# EAGLE schematic Soap (EAGLE 7.2.0)

## Sheet 1 of 2
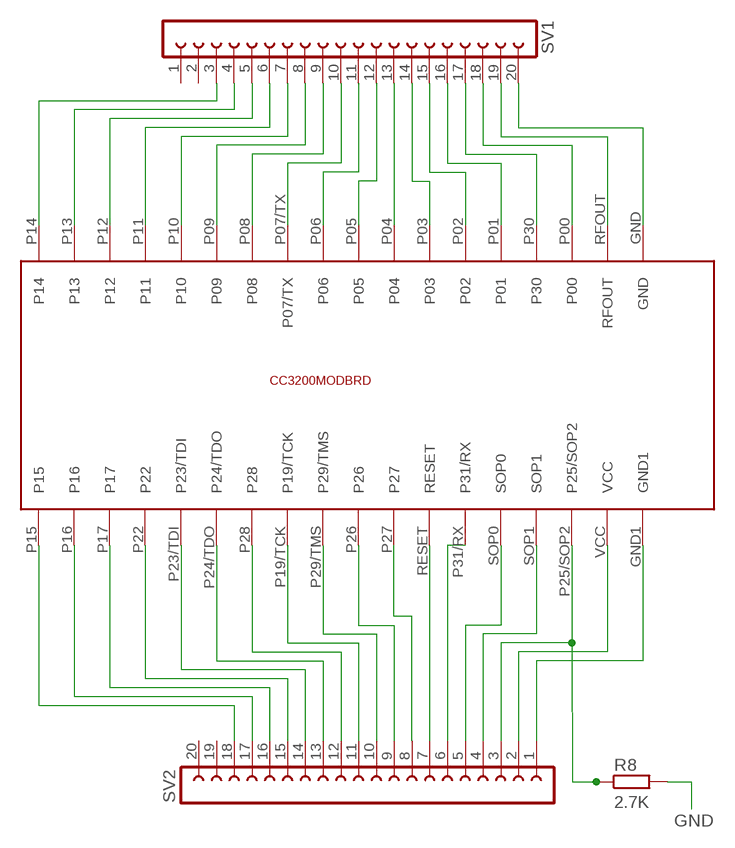
[diagram p0: schematic, sheet 1]

### Parts
R8  2.7K  RESISTOR  [R0603]
SV1  FE20-1  [FE20]
SV2  FE20-1  [FE20]
U$1  CC3200MOD  [CC3200MOD]

### Nets
+3V3: SV2.2 U$1.VCC
GND [vcc]: R8.2 SV1.20 SV2.1 U$1.GND U$1.GND1 ; also sheet 2
N$4: SV2.18 U$1.P15
N$6: SV2.17 U$1.P16
N$7: SV2.16 U$1.P17
N$8: SV2.15 U$1.P22
N$9: SV2.14 U$1.P23/TDI
N$10: SV2.13 U$1.P24/TDO
N$11: SV2.12 U$1.P28
N$12: SV2.11 U$1.P19/TCK
N$13: SV2.10
N$14: SV1.3 U$1.P14
N$15: SV1.4 U$1.P13
N$16: SV1.5 U$1.P12
N$17: SV1.6 U$1.P11
N$18: SV1.7 U$1.P10
N$19: SV1.8 U$1.P09
N$20: SV1.9 U$1.P08
N$21: SV1.10 U$1.P07/TX
N$22: SV1.11 U$1.P06
N$23: SV1.12 U$1.P05
N$24: SV1.13 U$1.P04
N$25: SV1.14 U$1.P03
N$26: SV1.15 U$1.P02
N$27: SV1.16 U$1.P01
N$28: SV1.17 U$1.P30
N$29: SV1.18 U$1.P00
N$30: SV1.19 U$1.RFOUT
N$32: SV2.9 U$1.P26
N$33: SV2.8 U$1.P27
N$34: SV2.7 U$1.RESET
N$35: SV2.6 U$1.P31/RX
N$36: SV2.5 U$1.SOP0
N$37: SV2.4 U$1.SOP1
SOP2: R8.1 SV2.3 U$1.P25/SOP2
Unconnected: SV1.1 SV1.2 SV2.19 SV2.20 U$1.P29/TMS

## Sheet 2 of 2
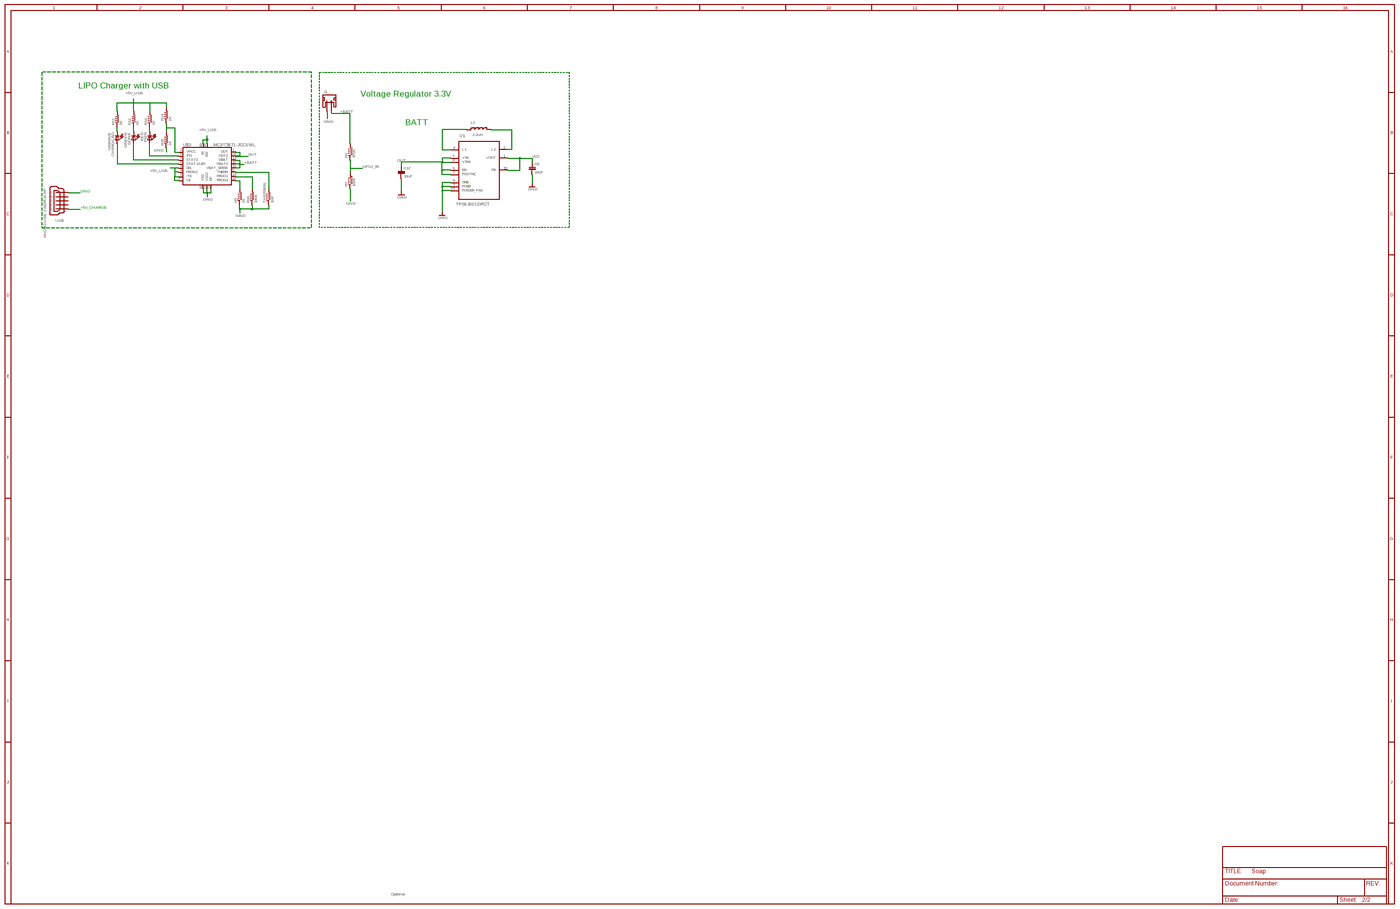
[diagram p1: schematic, sheet 2, overview]
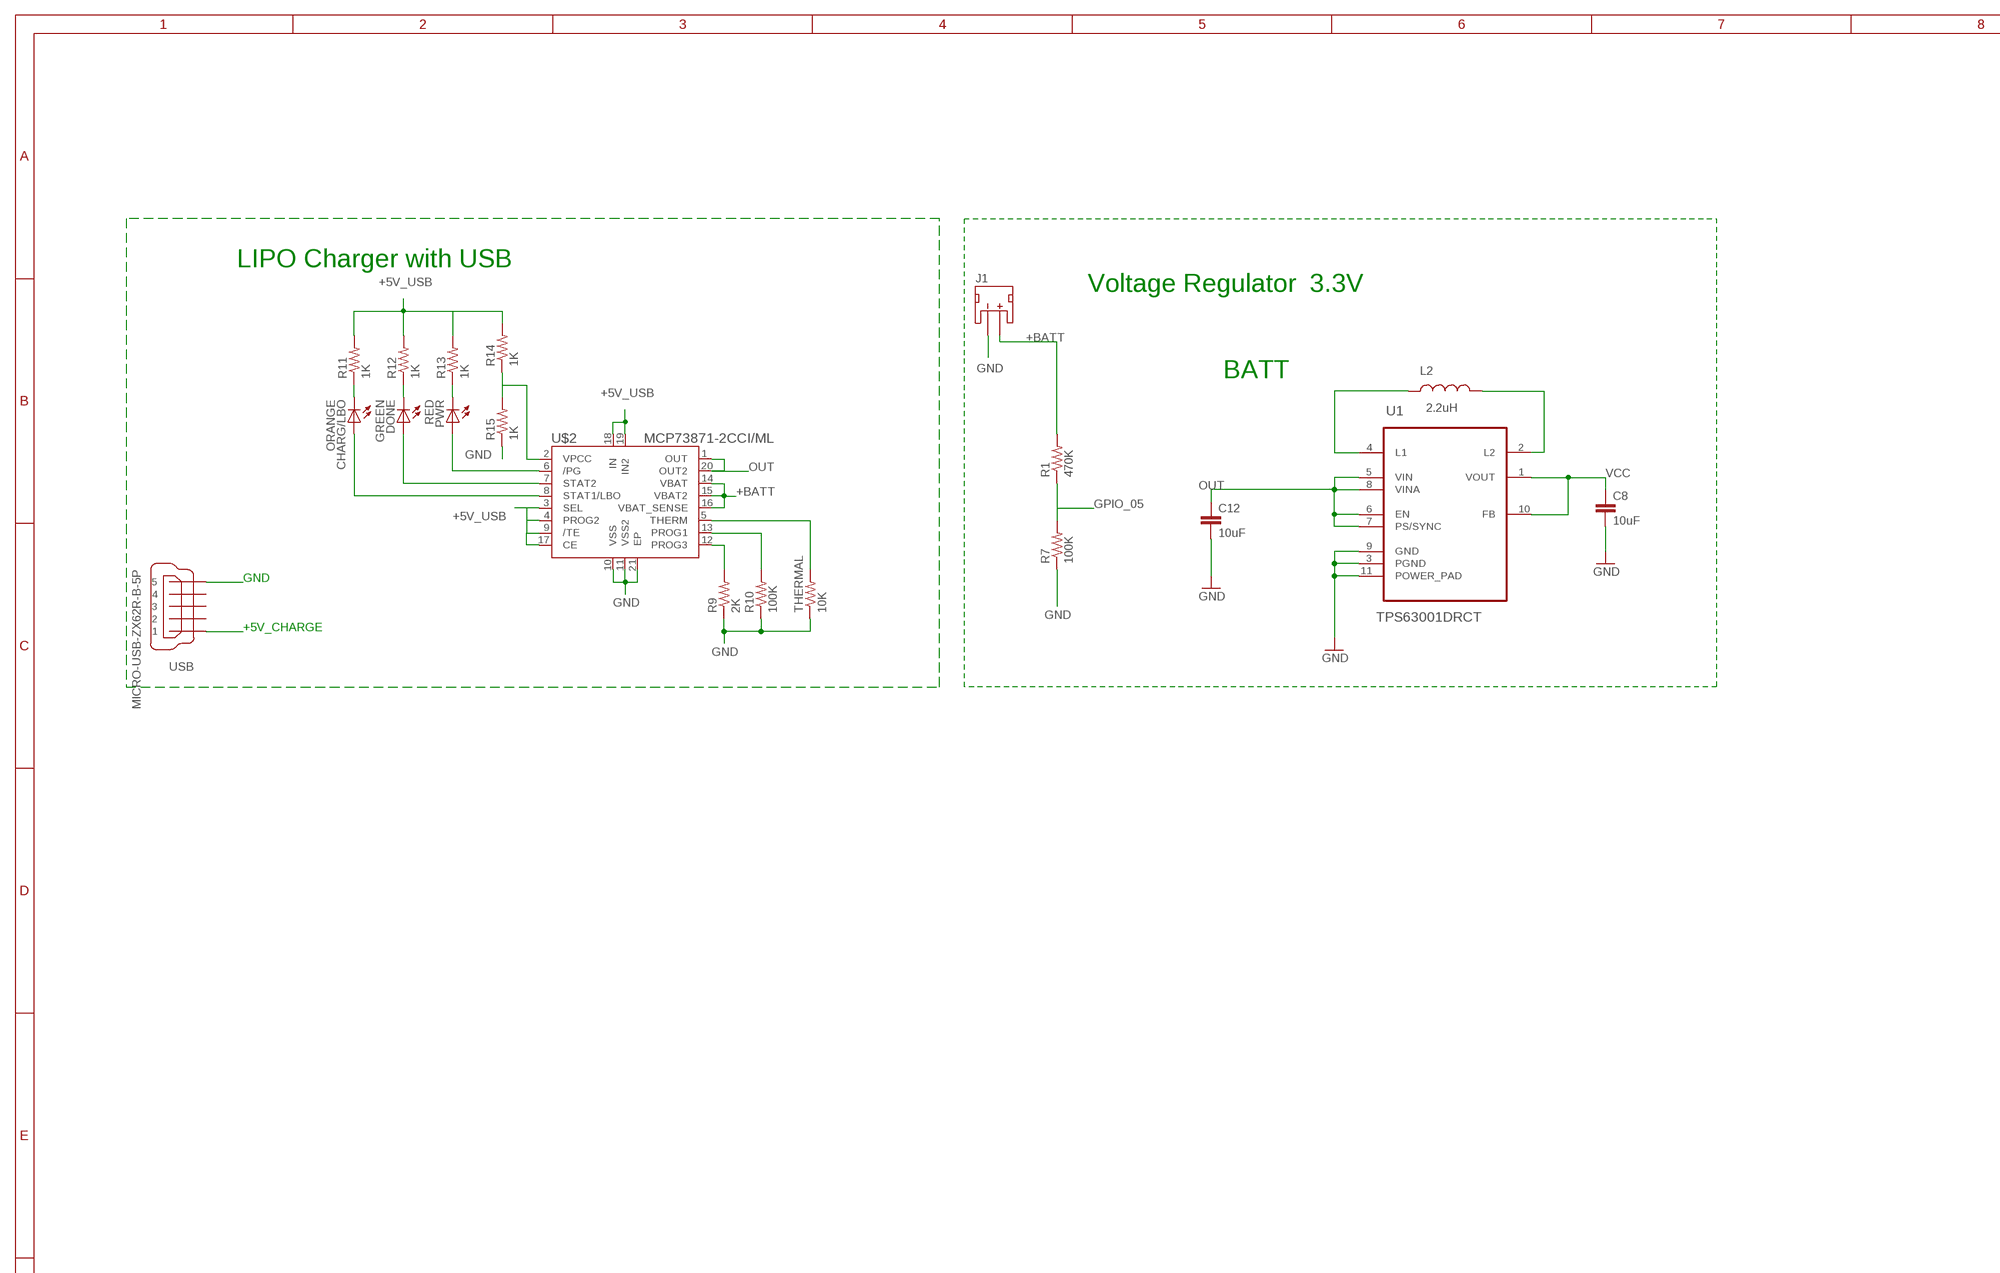
[diagram p2: schematic, sheet 2, part 1 of 4]
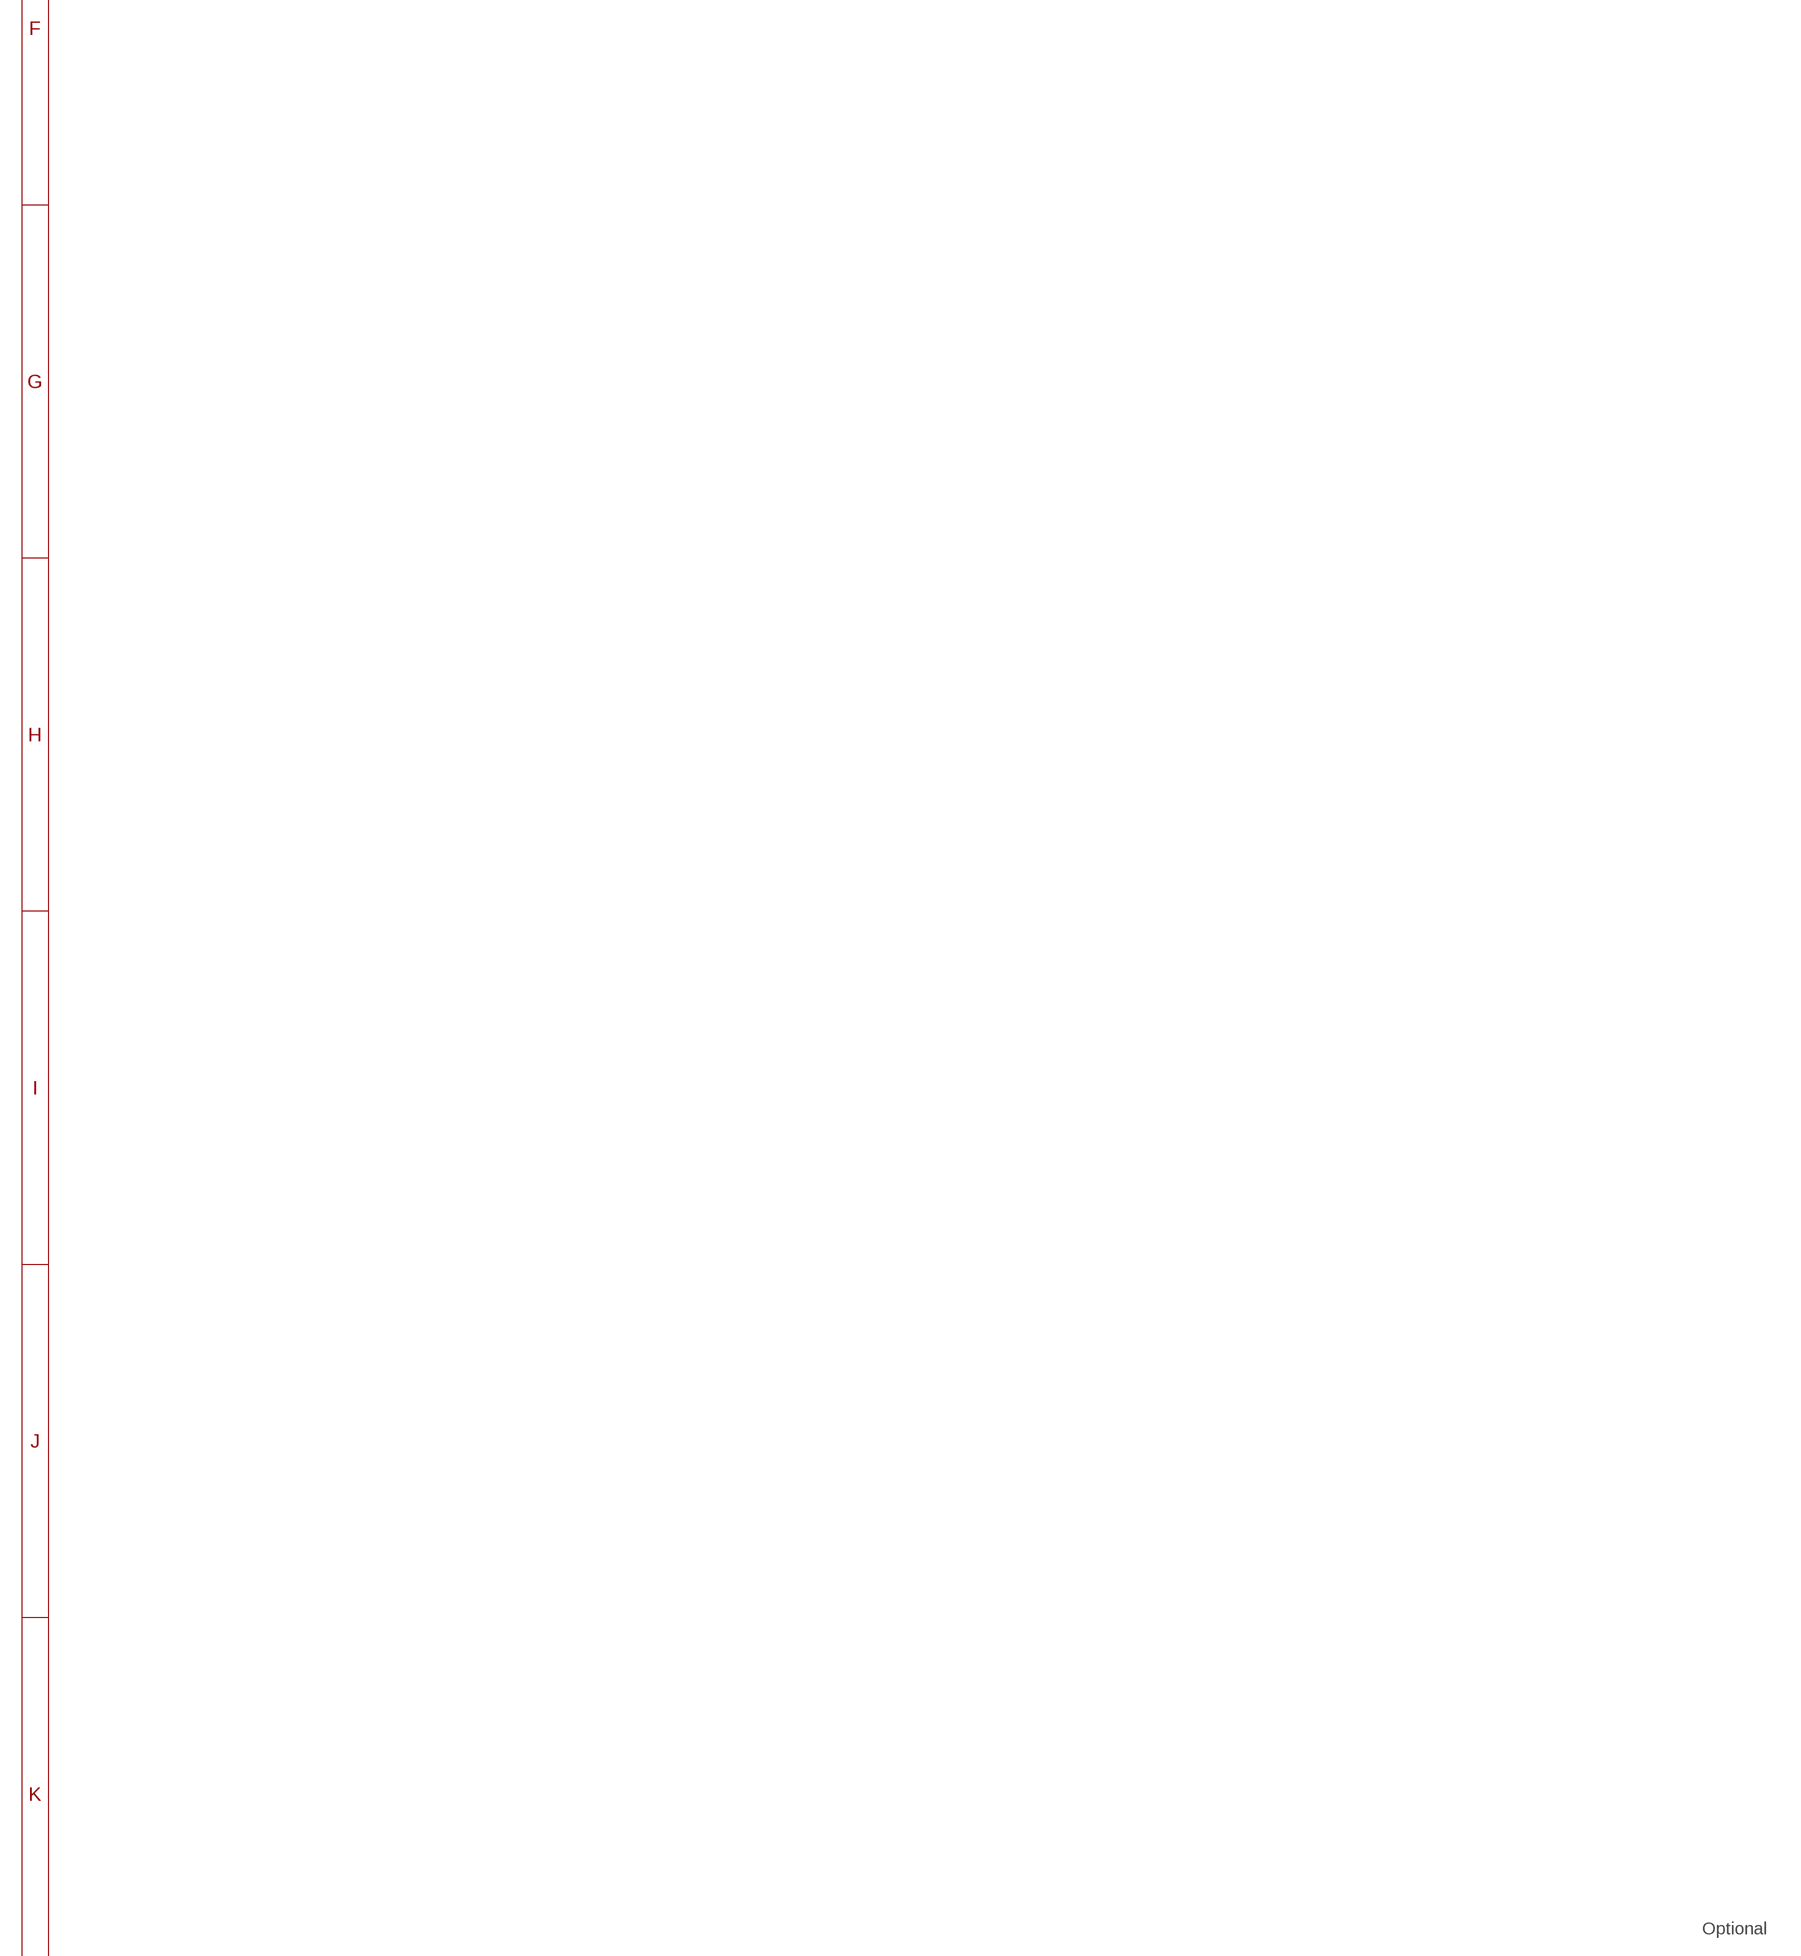
[diagram p3: schematic, sheet 2, part 2 of 4]
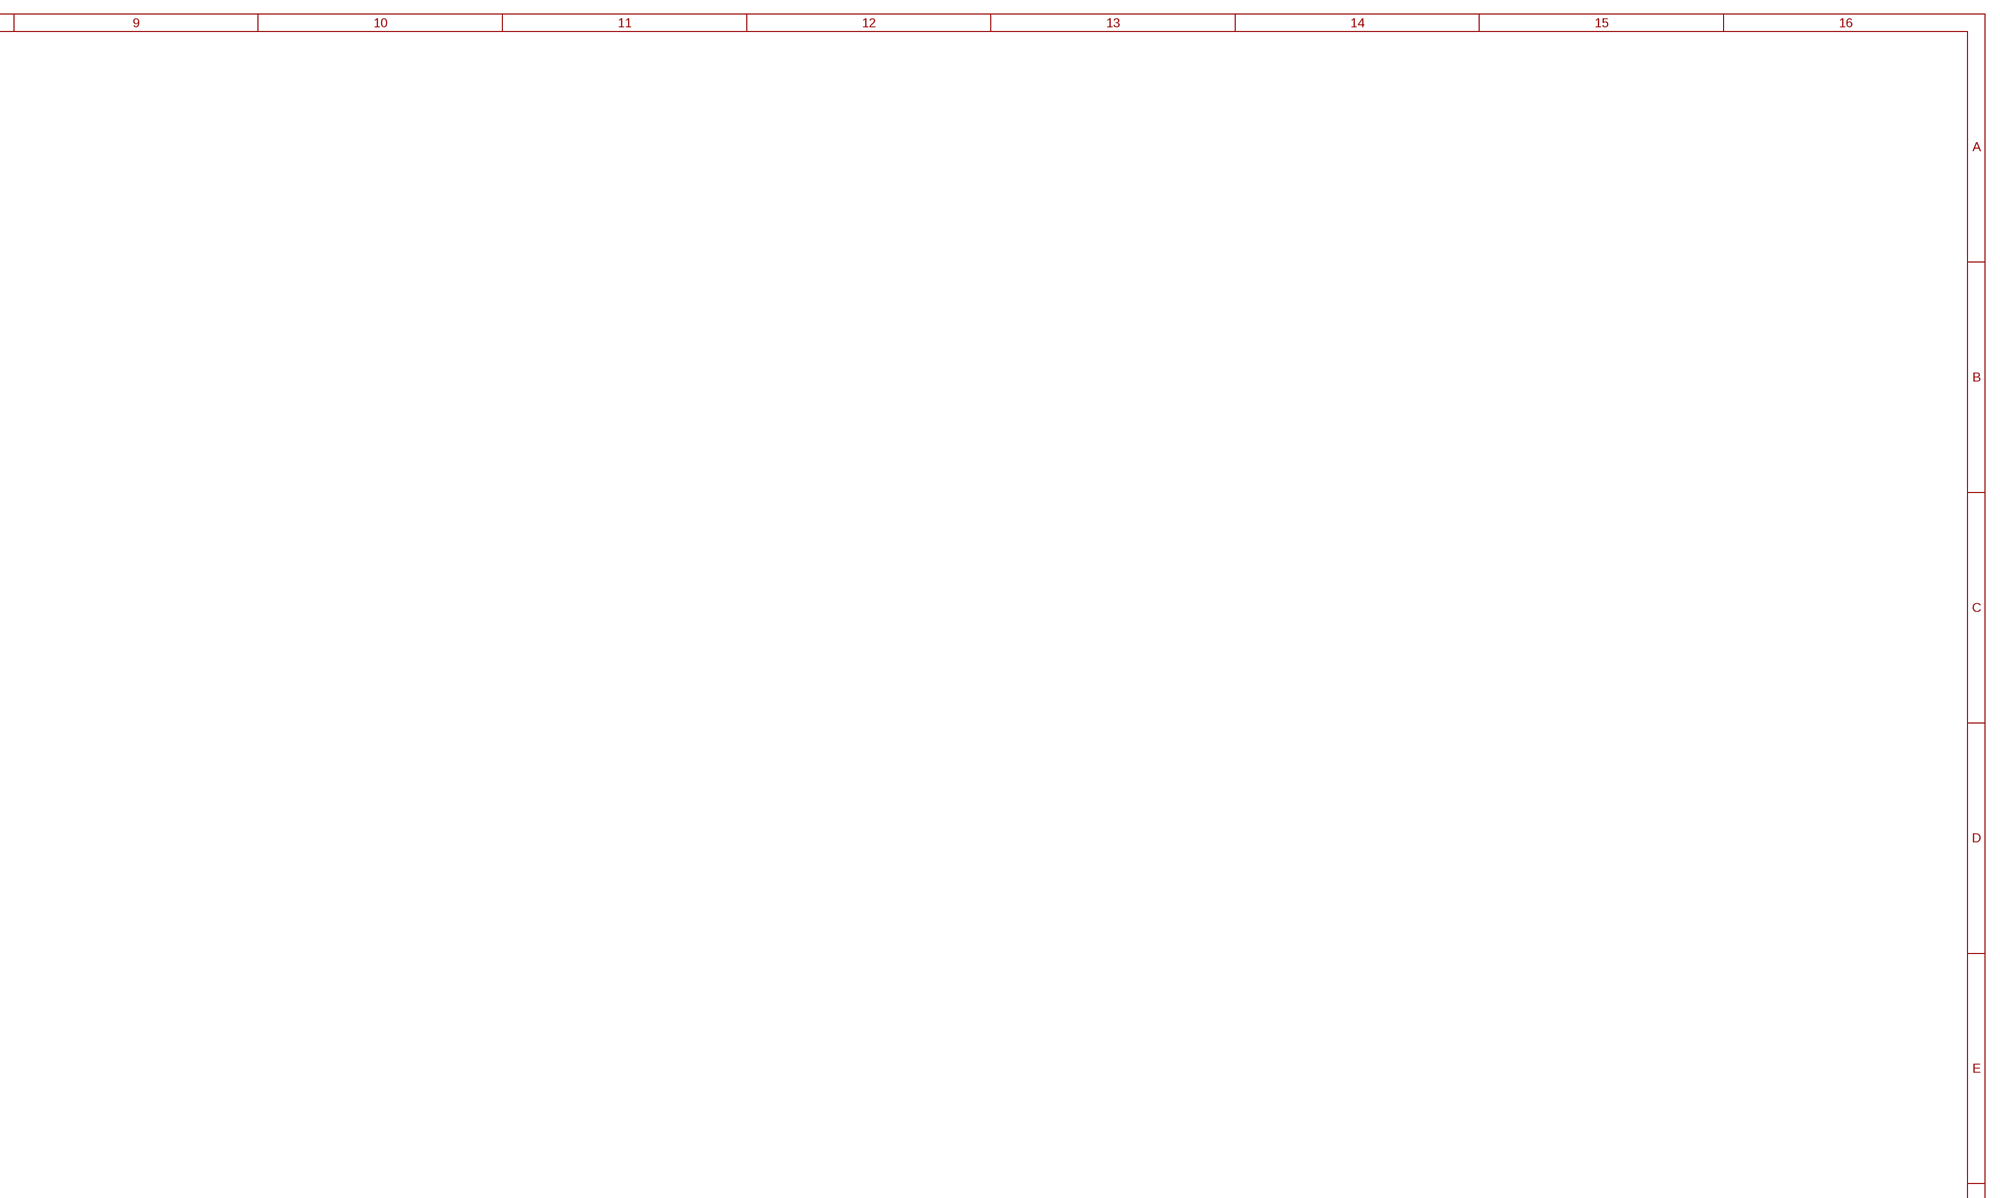
[diagram p4: schematic, sheet 2, part 3 of 4]
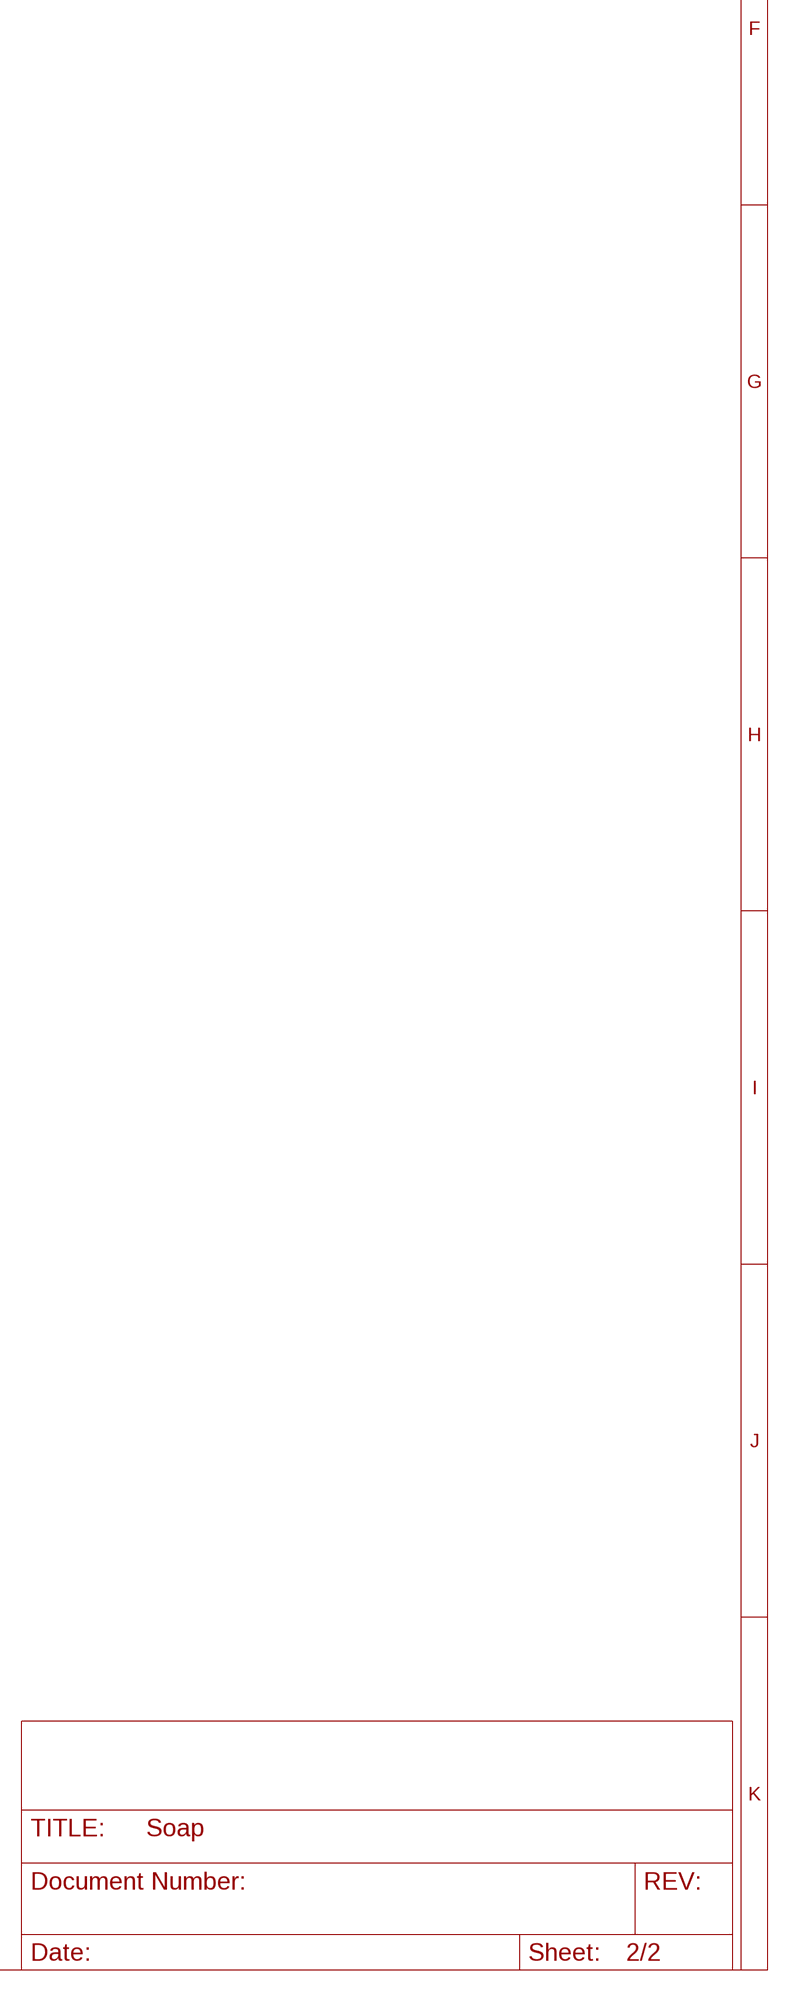
[diagram p5: schematic, sheet 2, part 4 of 4]

### Parts
C8  10uF  C-EUC0603  [C0603]
C12  10uF  C-EUC0603  [C0603]
CHARG/LBO  ORANGE  LEDSML0603  [SML0603]
DONE  GREEN  LEDSML0603  [SML0603]
J1  JST_2MM_MALE  [JST-2-SMD]
L2  2.2uH  INDUCTOR0805  [0805]
PWR  RED  LEDSML0603  [SML0603]
R1  470K  RESISTOR0603  [0603-RES]
R7  100K  RESISTOR0603  [0603-RES]
R9  2K  RESISTOR0603-RES  [0603-RES]
R10  100K  RESISTOR0603-RES  [0603-RES]
R11  1K  RESISTOR0603-RES  [0603-RES]
R12  1K  RESISTOR0603-RES  [0603-RES]
R13  1K  RESISTOR0603-RES  [0603-RES]
R14  1K  RESISTOR0603-RES  [0603-RES]
R15  1K  RESISTOR0603-RES  [0603-RES]
THERMAL  10K  RESISTOR0603-RES  [0603-RES]
U1  TPS63001DRCT  [SON50P300X300X100-11N]
U$2  MCP73871-2CCI/ML  [QFN20-4X4]
USB  MICRO-USB-ZX62R-B-5P  [ZX62R-B-5P]

### Nets
+5V_USB: R11.2 R12.2 R13.2 R14.2 U$2.3(SEL) U$2.4(PROG2) U$2.9(/TE) U$2.17(CE) U$2.18(IN) U$2.19(IN2) USB.1
+BATT: J1.2(+) R1.2 U$2.14(VBAT) U$2.15(VBAT2) U$2.16(VBAT_SENSE)
GND [vcc]: C8.2 C12.2 J1.1(-) R7.1 R9.1 R10.1 R15.1 THERMAL.1 U1.3(PGND) U1.9(GND) U1.11(POWER_PAD) U$2.10(VSS) U$2.11(VSS2) U$2.21(EP) USB.5 ; also sheet 1
GPIO_05: R1.1 R7.2
N$52: L2.1 U1.4(L1)
N$53: L2.2 U1.2(L2)
N$55: R9.2 U$2.12(PROG3)
N$56: R10.2 U$2.13(PROG1)
N$57: PWR.A U$2.6(/PG)
N$58: DONE.A U$2.7(STAT2)
N$59: CHARG/LBO.A U$2.8(STAT1/LBO)
N$60: CHARG/LBO.C R11.1
N$61: DONE.C R12.1
N$62: PWR.C R13.1
N$63: R14.1 R15.2 U$2.2(VPCC)
N$64: THERMAL.2 U$2.5(THERM)
OUT: C12.1 U1.5(VIN) U1.6(EN) U1.7(PS/SYNC) U1.8(VINA) U$2.1(OUT) U$2.20(OUT2)
VCC: C8.1 U1.1(VOUT) U1.10(FB)
Unconnected: J1.NC1(PAD1) J1.NC2(PAD2) USB.2 USB.3 USB.4

### Notes on the sheet
- LIPO Charger with USB
- Voltage Regulator | 3.3V
- BATT
- GND
- +5V_CHARGE
- Optional

## Library data of the parts
C8 C12 = rcl:C-EU: CAPACITOR, European symbol
CHARG/LBO DONE PWR = led:LED: LED OSRAM: - CHIPLED LG R971, LG N971, LY N971, LG Q971, LY Q971, LO R971, LY R971 LH N974, LH R974 LS Q976, LO Q976, LY Q976 LO Q996 - Hyper CHIPLED LW Q18S LB Q993, LB Q99A, LB R99A - SideLED LS A670, LO A670, LY A670, LG A670, LP A670 LB A673, LV A673, LT A673, LW A673 LH A674 LY A675 LS A676, LA A676, LO A676, LY A676, LW A676 LS A679, LY A679, LG A679 - Hyper Micro SIDELED® LS Y876, LA Y876, LO Y876, LY Y876 LT Y87S - SmartLED LW L88C, LW L88S LB L89C, LB L89S, LG L890 LS L89K, LO L89K, LY L89K LS L896, LA L896, LO L896, LY L896 - TOPLED LS T670, LO T670, LY T670, LG T670, LP T670 LSG T670, LSP T670, LSY T670, LOP T670, LYG T670 LG T671, LOG T671, LSG T671 LB T673, LV T673, LT T673, LW T673 LH T674 LS T676, LA T676, LO T676, LY T676, LB T676, LH T676, LSB T676, LW T676 LB T67C, LV T67C, LT T67C, LS T67K, LO T67K, LY T67K, LW E67C LS E67B, LA E67B, LO E67B, LY E67B, LB E67C, LV E67C, LT E67C LW T67C LS T679, LY T679, LG T679 LS T770, LO T770, LY T770, LG T770, LP T770 LB T773, LV T773, LT T773, LW T773 LH T774 LS E675, LA E675, LY E675, LS T675 LS T776, LA T776, LO T776, LY T776, LB T776 LHGB T686 LT T68C, LB T68C - Hyper Mini TOPLED® LB M676 - Mini TOPLED Santana® LG M470 LS M47K, LO M47K, LY M47K Source: http://www.osram.convergy.de LUXEON: - LUMILED® LXK2-PW12-R00, LXK2-PW12-S00, LXK2-PW14-U00, LXK2-PW14-V00 LXK2-PM12-R00, LXK2-PM12-S00, LXK2-PM14-U00 LXK2-PE12-Q00, LXK2-PE12-R00, LXK2-PE12-S00, LXK2-PE14-T00, LXK2-PE14-U00 LXK2-PB12-K00, LXK2-PB12-L00, LXK2-PB12-M00, LXK2-PB14-N00, LXK2-PB14-P00, LXK2-PB14-Q00 LXK2-PR12-L00, LXK2-PR12-M00, LXK2-PR14-Q00, LXK2-PR14-R00 LXK2-PD12-Q00, LXK2-PD12-R00, LXK2-PD12-S00 LXK2-PH12-R00, LXK2-PH12-S00 LXK2-PL12-P00, LXK2-PL12-Q00, LXK2-PL12-R00 Source: www.luxeon.com KINGBRIGHT: KA-3528ASYC Source: www.kingbright.com
J1 = SparkFun-Connectors:JST_2MM_MALE: Mates to single-cell LiPo batteries. CONN-08352; PROD_ID: CONN-08352
L2 = SparkFun-Passives:INDUCTOR: Inductors Basic Inductor/Choke - 0603 and 1206. Footprints are not proven and vary greatly between part numbers. SRN6045- 33uH, 20% 1.4A SDR0403-560KL - 56uH, 10%, 500mA RMS/740mA peak
R1 R7 = SparkFun-Resistors:RESISTOR: Resistor Basic schematic elements and footprints for 0603, 1206, and PTH resistors.
R8 = BaseApp:RESISTOR: Resistance Package :- 0603 Mount :-Surface mount
R9-R15 THERMAL = SparkFun-Passives:RESISTOR: Resistor Basic schematic elements and footprints for 0603, 1206, and PTH resistors.
SV1 SV2 = con-lsta:FE20-1: FEMALE HEADER; OC_FARNELL: unknown; OC_NEWARK: unknown
U1 = TPS63001:TPS63001DRCT: HIGH EFFICIENT SINGLE INDUCTOR BUCK-BOOST CONVERTER WITH 1.8-A SWITCHES; MPN: TPS63001DRCT; OC_FARNELL: 1652399; OC_NEWARK: 22M1824; PACKAGE: SON-10; SUPPLIER: TEXAS INSTRUMENTS
U$1 = CC3200MODBRD:CC3200MOD
U$2 = microchip-battery:MCP73871: Stand-Alone System Load Sharing and Li-Ion / Li-Polymer Battery Charge Managemen The MCP73871 device is a 1A fully integrated linear solution for system load sharing and Li-Ion / Li-Polymer battery charge management with AC-DC wall adapter and USB port power sources selection. It?s also capable of autonomous power source selection between input or battery. The MCP73871 device employs a constant current/constant voltage (CC/CV) charge algorithm with selectable charge termination point. The constant voltage regulation is fixed with four available options: 4.10V, 4.20V, 4.35V, or 4.40V.; LBO: 3.1 V; SAFETYTIMER: 6 Hours; VREG: 4.20V
USB = con-hirose:MICRO-USB-: Hirose Micro USB Connector ZX62R-B-5P: Micro B, reverse (top mount) shell SMT Supplier: DigiKey H11574CT-ND Source: http://www.hirose.co.jp/cataloge_hp/e24200011.pdf

## Net classes
2 RF: width 0.381 mm, clearance 0.381 mm